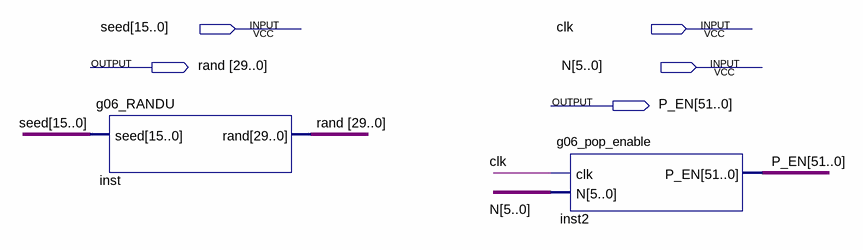
[diagram p0: schematic sheet]
// Quartus schematic g06_lab2.bdf as structural Verilog: 2 symbols, 5 pins
module g06_lab2 (
  input  [15:0] seed,
  input  clk,
  input  [5:0] N,
  output [29:0] \rand ,
  output [51:0] P_EN
);

  g06_RANDU inst (.seed(seed), .\rand (\rand ));
  g06_pop_enable inst2 (.clk(clk), .N(N), .P_EN(P_EN));
endmodule
